# EAGLE schematic IMD (EAGLE 9.2.2)
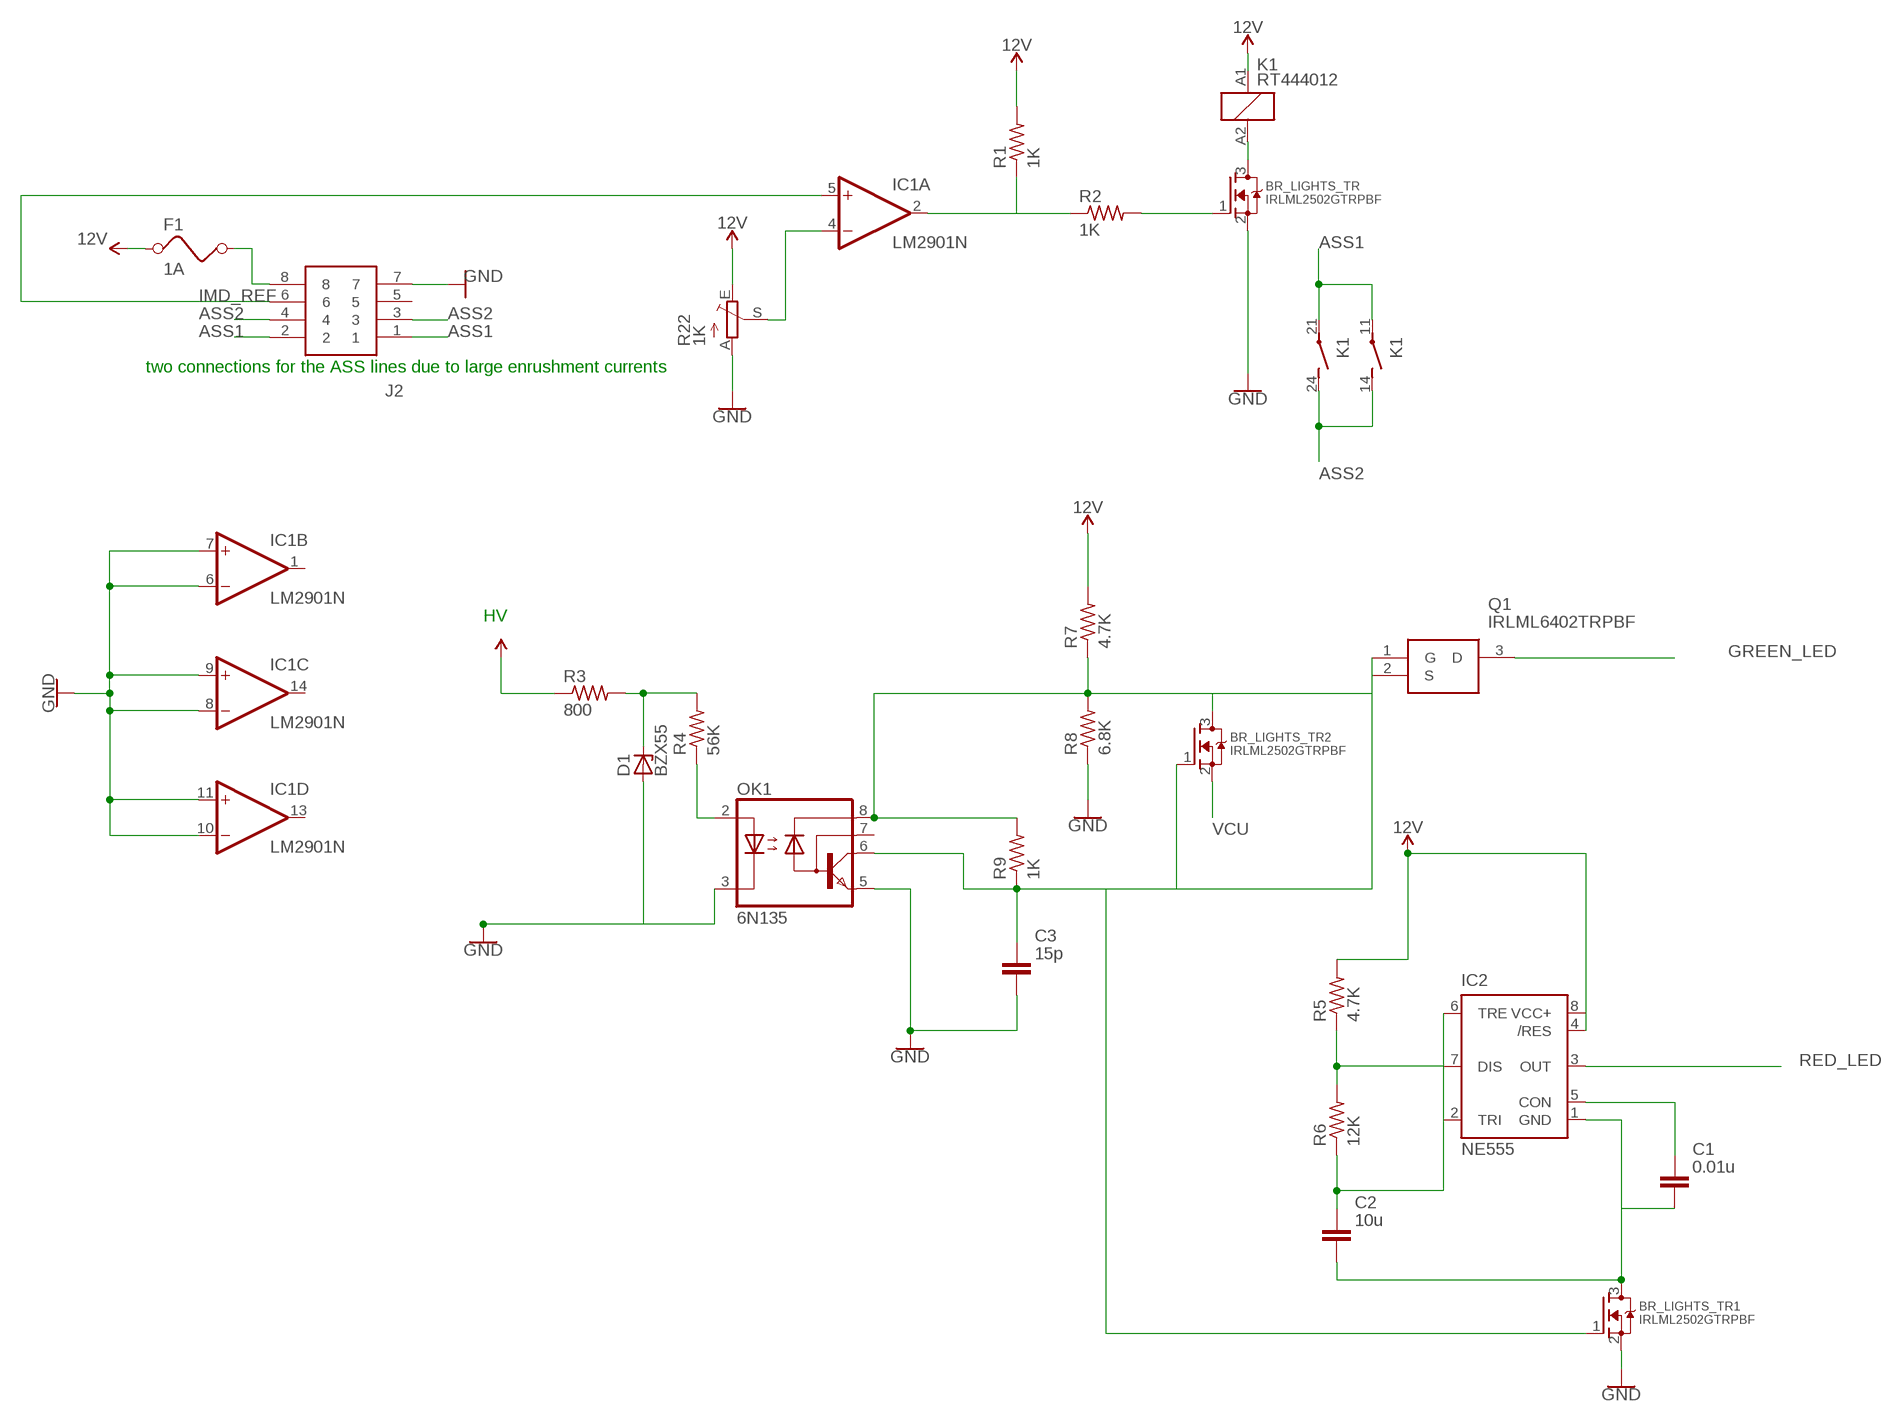
[diagram p0: schematic, sheet 1]

## Parts
BR_LIGHTS_TR  IRLML2502GTRPBF  MOSFET-NREFLOW  [SOT23]
BR_LIGHTS_TR1  IRLML2502GTRPBF  MOSFET-NREFLOW  [SOT23]
BR_LIGHTS_TR2  IRLML2502GTRPBF  MOSFET-NREFLOW  [SOT23]
C1  0.01u  C  (no package)
C2  10u  C  (no package)
C3  15p  C  (no package)
D1  BZX55  [DO35Z10]
F1  1A  FUSE  [FUSE]
IC1  LM2901N  [DIL14]
IC2  NE555  [DIL-08]
J2  T821108A1S100CEU  [HDRV8W64P254_2X4_1778X895X915P]
K1  RT444012  [RT2N/O]
OK1  6N135  [DIL08]
Q1  IRLML6402TRPBF  [SOT95P237X112-3N]
R1  1K  R-US_0204/7  [0204/7]
R2  1K  R-US_0204/7  [0204/7]
R3  800  R-US_0204/7  [0204/7]
R4  56K  R-US_0204/7  [0204/7]
R5  4.7K  R-US_0204/7  [0204/7]
R6  12K  R-US_0204/7  [0204/7]
R7  4.7K  R-US_0204/7  [0204/7]
R8  6.8K  R-US_0204/7  [0204/7]
R9  1K  R-US_0204/7  [0204/7]
R22  1K  TRIM_EU-B90P  [SP19L]

## Nets
12V: F1.1 IC2.4(/RES) IC2.8(VCC+) K1.A1 R1.2 R5.2 R7.2 R22.E
ASS1: J2.1 J2.2 K1.11(2:P) K1.21(3:P)
ASS2: J2.3 J2.4 K1.14(2:S) K1.24(3:S)
GND: BR_LIGHTS_TR1.2(S) BR_LIGHTS_TR.2(S) C3.2 D1.A IC1.6(B:-IN) IC1.7(B:+IN) IC1.8(C:-IN) IC1.9(C:+IN) IC1.10(D:-IN) IC1.11(D:+IN) J2.7 OK1.3(C) OK1.5(GND) R8.1 R22.A
GREEN_LED: Q1.3(D)
IMD_REF: IC1.5(A:+IN) J2.6
N$1: IC1.2(A:OUT) R1.1 R2.1
N$2: F1.2 J2.8
N$3: BR_LIGHTS_TR.1(G) R2.2
N$4: IC1.4(A:-IN) R22.S
N$5: R3.1 ; supply symbol labelled 140V
N$6: BR_LIGHTS_TR.3(D) K1.A2
N$7: OK1.2(A) R4.1
N$8: D1.C R3.2 R4.2
N$10: C1.1 IC2.5(CON)
N$11: IC2.7(DIS) R5.1 R6.2
N$12: C2.1 IC2.2(TRI) IC2.6(TRE) R6.1
N$13: BR_LIGHTS_TR1.1(G) BR_LIGHTS_TR2.1(G) C3.1 OK1.6(VO) Q1.1(G) R9.1
N$14: BR_LIGHTS_TR1.3(D) C1.2 C2.2 IC2.1(GND)
N$16: BR_LIGHTS_TR2.3(D) OK1.8(VCC) Q1.2(S) R7.1 R8.2 R9.2
RED_LED: IC2.3(OUT)
VCU: BR_LIGHTS_TR2.2(S)
Unconnected: IC1.1(B:OUT) IC1.13(D:OUT) IC1.14(C:OUT) J2.5 OK1.7(VB)

## Notes on the sheet
- two connections for the ASS lines due to large enrushment currents
- HV

## Power pins joined to a net without a drawn wire
V+: IC1.3(P:V+)
V-: IC1.12(P:V-)

## Library data of the parts
BR_LIGHTS_TR BR_LIGHTS_TR1 BR_LIGHTS_TR2 = adafruit:MOSFET-N: N-Channel Mosfet 2N7002E - 60V 260mA SOT23 [Digikey: 2N7002ET1GOSTR-ND] - REEL BSH103 - 30V 850mA SOT23 [Digikey: 568-5013-1-ND]
C1-C3 = ngspice-simulation:C: CAPACITOR
D1 = diode:BZX55: Z DIODE
F1 = special:FUSE: FUSE 5 x 20 mm
IC1 = linear:LM2901: COMPARATOR
IC2 = st-microelectronics:NE555: General purpose bipolar Timer; MF: Arrow Electronics; MPN: NE555N; OC_FARNELL: 1467742; OC_NEWARK: 89K1486
J2 = T821108A1S100CEU:T821108A1S100CEU: HEADER, VERTICAL, 2.54MM, 8WAY Amphenol T821 Series, 2.54mm Pitch 8 Way 2 Row Straight PCB Header, Solder Termination, 3A Source: Datasheet <http://uk.rs-online.com/web/p/products/1702738>; DESCRIPTION: HEADER, VERTICAL, 2.54MM, 8WAY Amphenol T821 Series, 2.54mm Pitch 8 Way 2 Row Straight PCB Header, Solder Termination, 3A; HEIGHT: 9.15mm; MANUFACTURER_NAME: Amphenol; MANUFACTURER_PART_NUMBER: T821108A1S100CEU; RS_PART_NUMBER: 1702738
K1 = relay:RT44?*: Power PCB Relay SCHRACK 2 pole 8 A, DC and AC-coil Source: http://www.schrack.com/.. 5842.pdf; OC_FARNELL: unknown; OC_NEWARK: unknown
OK1 = optocoupler:6N135: MOTOROLA OPTO COUPLER; MF: FAIRCHILD SEMICONDUCTOR; MPN: 6N135; OC_FARNELL: 1021342; OC_NEWARK: 58K9658
Q1 = SamacSys_Parts:IRLML6402TRPBF: MOSFET MOSFT P-Ch -3.7A 65mOhm 8nC Log Lvl Source: Datasheet <https://componentsearchengine.com/Datasheets/1/IRLML6402TRPBF.pdf>; DESCRIPTION: MOSFET MOSFT P-Ch -3.7A 65mOhm 8nC Log Lvl; HEIGHT: 1.12mm; MANUFACTURER_NAME: Infineon; MANUFACTURER_PART_NUMBER: IRLML6402TRPBF; MOUSER_PART_NUMBER: 942-IRLML6402TRPBF; MOUSER_PRICE-STOCK: https://www.mouser.com/Search/Refine.aspx?Keyword=942-IRLML6402TRPBF
R1-R9 = adafruit:R-US_: RESISTOR, American symbol
R22 = pot:TRIM_EU-: POTENTIOMETER